# Altium schematic sheet MPU-Control.SchDoc
size A
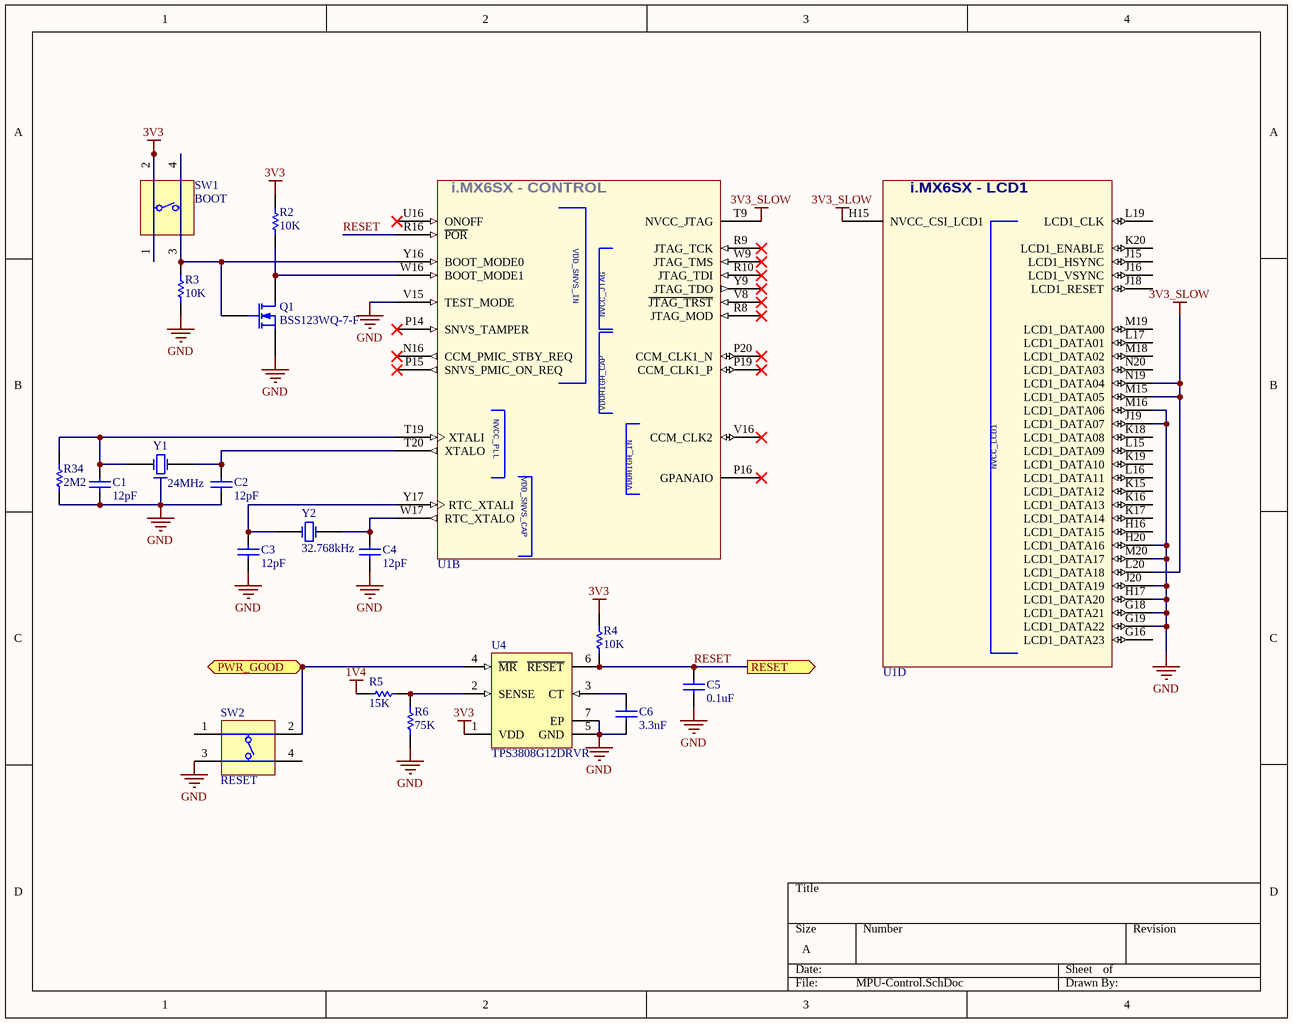
[diagram p0: MPU-Control.SchDoc]

## Parts
C1  value 12pF  [C0402[1005X55]]  (hidden comment: 12pF 50V 0402)
C2  value 12pF  [C0402[1005X55]]  (hidden comment: 12pF 50V 0402)
C3  value 12pF  [C0402[1005X55]]  (hidden comment: 12pF 50V 0402)
C4  value 12pF  [C0402[1005X55]]  (hidden comment: 12pF 50V 0402)
C5  value 0.1uF  [C0402[1005X55]]  (hidden comment: 0.1uF 6.3V 0402)
C6  value 3.3nF  [C0402[1005X55]]  (hidden comment: 3.3nF 50V 0402)
Q1  BSS123WQ-7-F  [SOT323-3]
R2  value 10K  [R0402[1005]]  (hidden comment: 10K 1% 0402)
R3  value 10K  [R0402[1005]]  (hidden comment: 10K 1% 0402)
R4  value 10K  [R0402[1005]]  (hidden comment: 10K 1% 0402)
R5  value 15K  [R0402[1005]]  (hidden comment: 15K 1% 0402)
R6  value 75K  [R0402[1005]]  (hidden comment: 75K 1% 0402)
R34  value 2M2  [R0402[1005]]  (hidden comment: 2M2 1% 0402)
SW1  BOOT  [SWITCH]
SW2  RESET  [SWITCH]
U1  MCIMX6X3EVO10AB  [BGA-400]  (value not drawn)  (parts B,D of 12)
U4  TPS3808G12DRVR  [DRV0006A_V]
Y1  24MHz  [CRYSTAL_2.0x1.6]
Y2  32.768kHz  [CRYSTAL_2.0x1.2]

## Ports
PWR_GOOD (in), RESET (out)

## Nets
1V4: R5.2
3V3: R2.2 R4.2 SW1.1(T1) SW1.2(T2) U4.1(VDD)
3V3_SLOW: U1.H15(NVCC_CSI_LCD1) U1.L20(LCD1_DATA18) U1.M15(LCD1_DATA05) U1.N19(LCD1_DATA04) U1.T9(NVCC_JTAG)
GND: C1.1 C2.1 C3.1 C4.1 C5.1 C6.1 Q1.2(S) R3.1 R6.1 R34.1 SW2.3(T3) U1.G18(LCD1_DATA21) U1.G19(LCD1_DATA22) U1.H17(LCD1_DATA20) U1.H20(LCD1_DATA16) U1.J19(LCD1_DATA07) U1.J20(LCD1_DATA19) U1.M16(LCD1_DATA06) U1.M20(LCD1_DATA17) U1.V15(TEST_MODE) U4.5(GND) U4.7(EP) Y1.2
PWR_GOOD: SW2.2(T2) U4.4(~{MR}) ; port PWR_GOOD
RESET: C5.2 R4.1 U1.R16(~{POR}) U4.6(~{RESET}) ; port RESET
NetC1_2: C1.2 R34.2 U1.T19(XTALI) Y1.1(X1)
NetC2_2: C2.2 U1.T20(XTALO) Y1.3(X2)
NetC3_2: C3.2 U1.Y17(RTC_XTALI) Y2.1(X1)
NetC4_2: C4.2 U1.W17(RTC_XTALO) Y2.2(X2)
NetC6_2: C6.2 U4.3(CT)
NetQ1_1: Q1.1(G) R3.2 SW1.3(T3) SW1.4(T3) U1.Y16(BOOT_MODE0)
NetQ1_3: Q1.3(D) R2.1 U1.W16(BOOT_MODE1)
NetR5_1: R5.1 R6.2 U4.2(SENSE)

Not connected (* = marked no-connect by the designer): SW2 1(T1) 4(T3); U1 G16(LCD1_DATA23) H16(LCD1_DATA15) J15(LCD1_HSYNC) J16(LCD1_VSYNC) J18(LCD1_RESET) K15(LCD1_DATA12) K16(LCD1_DATA13) K17(LCD1_DATA14) K18(LCD1_DATA08) K19(LCD1_DATA10) K20(LCD1_ENABLE) L15(LCD1_DATA09) L16(LCD1_DATA11) L17(LCD1_DATA01) L19(LCD1_CLK) M18(LCD1_DATA02) M19(LCD1_DATA00) N16(CCM_PMIC_STBY_REQ)* N20(LCD1_DATA03) P14(SNVS_TAMPER)* P15(SNVS_PMIC_ON_REQ)* P16(GPANAIO)* P19(CCM_CLK1_P)* P20(CCM_CLK1_N)* R8(JTAG_MOD)* R9(JTAG_TCK)* R10(JTAG_TDI)* U16(ONOFF)* V8(~{JTAG_TRST})* V16(CCM_CLK2)* W9(JTAG_TMS)* Y9(JTAG_TDO)*

## Notes on the sheet
- (in symbol MCIMX6X3EVO10AB, part B) i.MX6SX - CONTROL; VDDHIGH_CAP; VDDHIGH_IN
- (in symbol MCIMX6X3EVO10AB, part D) i.MX6SX - LCD1; NVCC_LCD1

## Library data of the parts
C1-C4 = CAP_12pF_50V_0402_5%: 12pF 50V 5% 0402 (1005 Metric); PartNumber: GRM1555C1H120JA01D; Manufacturer: Murata; Mounting Technology: Surface Mount; PackageReference: 0402; PackageDescription: 0402 (1005 Metric); Voltage: 50V; Tolerance: 5%
C5 = CAP_0.1uF_6.3V_0402_10%: 0.1uF 6.3V 10% 0402 (1005 Metric); PartNumber: GRM155R70J104KA01D; Manufacturer: Murata; Mounting Technology: Surface Mount; PackageReference: 0402; PackageDescription: 0402 (1005 Metric); Voltage: 6.3V; Tolerance: 10%
C6 = CAP_3.3nF_50V_0402_10%: 3.3nF 50V 10% 0402 (1005 Metric); PartNumber: GRM155R71H332KA01D; Manufacturer: Murata; Mounting Technology: Surface Mount; PackageReference: 0402; PackageDescription: 0402 (1005 Metric); Voltage: 50V; Tolerance: 10%
Q1 = BSS123WQ-7-F: N-Channel MOSFET; Manufacturer: Diodes Incorporated; PartNumber: BSS123WQ-7-F; PackageReference: SOT-323-3; Mounting Technology: Surface Mount
R2-R4 = RES_10K_0402_1%: 10K 0.063W 1% 0402 (1005 Metric); Manufacturer: KOA Speer; PartNumber: RK73H1ETTP1002F; Tolerance: 1%; Power: 0.063W; Mounting Technology: Surface Mount; PackageReference: 0402; PackageDescription: 0402 (1005 Metric); ComponentLink1Description: Datasheet; ComponentLink1URL: http://www.koaspeer.com/catimages/Products/RK73H/RK73H.pdf
R5 = RES_15K_0402_1%: 15K 0.063W 1% 0402 (1005 Metric); Manufacturer: KOA Speer; PartNumber: RK73H1ETTP1502F; Tolerance: 1%; Power: 0.063W; Mounting Technology: Surface Mount; PackageReference: 0402; PackageDescription: 0402 (1005 Metric); ComponentLink1Description: Datasheet; ComponentLink1URL: http://www.koaspeer.com/catimages/Products/RK73H/RK73H.pdf
R6 = RES_75K_0402_1%: 75K 0.063W 1% 0402 (1005 Metric); Manufacturer: KOA Speer; PartNumber: RK73H1ETTP7502F; Tolerance: 1%; Power: 0.063W; Mounting Technology: Surface Mount; PackageReference: 0402; PackageDescription: 0402 (1005 Metric); ComponentLink1Description: Datasheet; ComponentLink1URL: http://www.koaspeer.com/catimages/Products/RK73H/RK73H.pdf
R34 = RES_2M2_0402_1%: 2M2 0.063W 1% 0402 (1005 Metric); Manufacturer: KOA Speer; PartNumber: RK73H1ETTP2204F; Tolerance: 1%; Power: 0.063W; Mounting Technology: Surface Mount; PackageReference: 0402; PackageDescription: 0402 (1005 Metric); ComponentLink1Description: Datasheet; ComponentLink1URL: http://www.koaspeer.com/catimages/Products/RK73H/RK73H.pdf
SW1 SW2 = DIPT-DTSM-6: Switch, SPNO Push Button SMD; Manufacturer: C&K Components; PartNumber: PTS810 SJM 250 SMTR LFS; Packing Type: Tape&Reel; Mechanical Life: 200,000 cycles; ComponentLink2URL: http://www.dip.com.tw/Products_tact.htm; ComponentLink1URL: http://www.dip.com.tw/; ComponentLink3URL: http://www.dip.com.tw/PDF/pro_tact/DTSM_G_-6_2_-V.pdf; PackageDescription: Switch, Surface Mount, 4 Leads, Body 4.6x2.8mm, Height 1.9mm; ComponentLink2Description: Datasheet; ComponentLink3Description: Package Specification; ComponentLink1Description: Manufacturer URL; PackageReference: PTS810; Mounting Technology: Surface Mount
U1 = MCIMX6X3EVO10AB: IC MPU I.MX6SX 1GHZ 400MAPBGA; Manufacturer: NXP; PartNumber: MCIMX6X3EVO10AB; Mounting Technology: Surface Mount; PackageReference: BGA-400
U4 = CMP-0332-00398-2: Low Quiescent Current, Programmable-Delay Supervisory Circuit, 1 Supply Monitored, -40 to 125 degC, 6-pin SON (DRV), Green (RoHS & no Sb/Br); Manufacturer: Texas Instruments; Threshold Voltage 1 (typ)(Typ)(V): 1.12; # of Supplies Monitored: 1; VCC(Max)(V): 6.5; Iq(Typ)(uA): 2.4; SubFamily: Supervisor and Reset IC; Reset Threshold Accuracy(%): 0.5; VCC(Min)(V): 1.7; Rating: Catalog; Output Driver Type / Reset Output: Active-low, Open-drain; Time Delay(ms): Programmable; Mounting Technology: Surface Mount; PackageDescription: 6-Pin Plastic Small Outline No-Lead, 2 x 2 x 0.8 mm Body, 0.65 mm Pitch, Exposed Pad; PartNumber: TPS3808G12DRVR; ComponentLink1Description: Datasheet; PackageVersion: revE, Oct-2010; ComponentLink1URL: http://www.ti.com/general/docs/lit/getliterature.tsp?genericPartNumber=TPS3808G12&fileType=pdf; PackageReference: DRV0006A; DatasheetVersion: SBVS050J
Y1 = FA-128 24.0000MF10Z-W3: Manufacturer: EPSON; PartNumber: FA-128 24.0000MF10Z-W3; Mounting Technology: Surface Mount; PackageReference: 4-SMD
Y2 = ABS06-32.768KHZ-9-1-T: Manufacturer: Abracon; PartNumber: ABS06-32.768KHZ-9-1-T; Mounting Technology: Surface Mount; PackageReference: 4-SMD